# Altium schematic sheet Power_System.SchDoc
size 297 x 209 mm
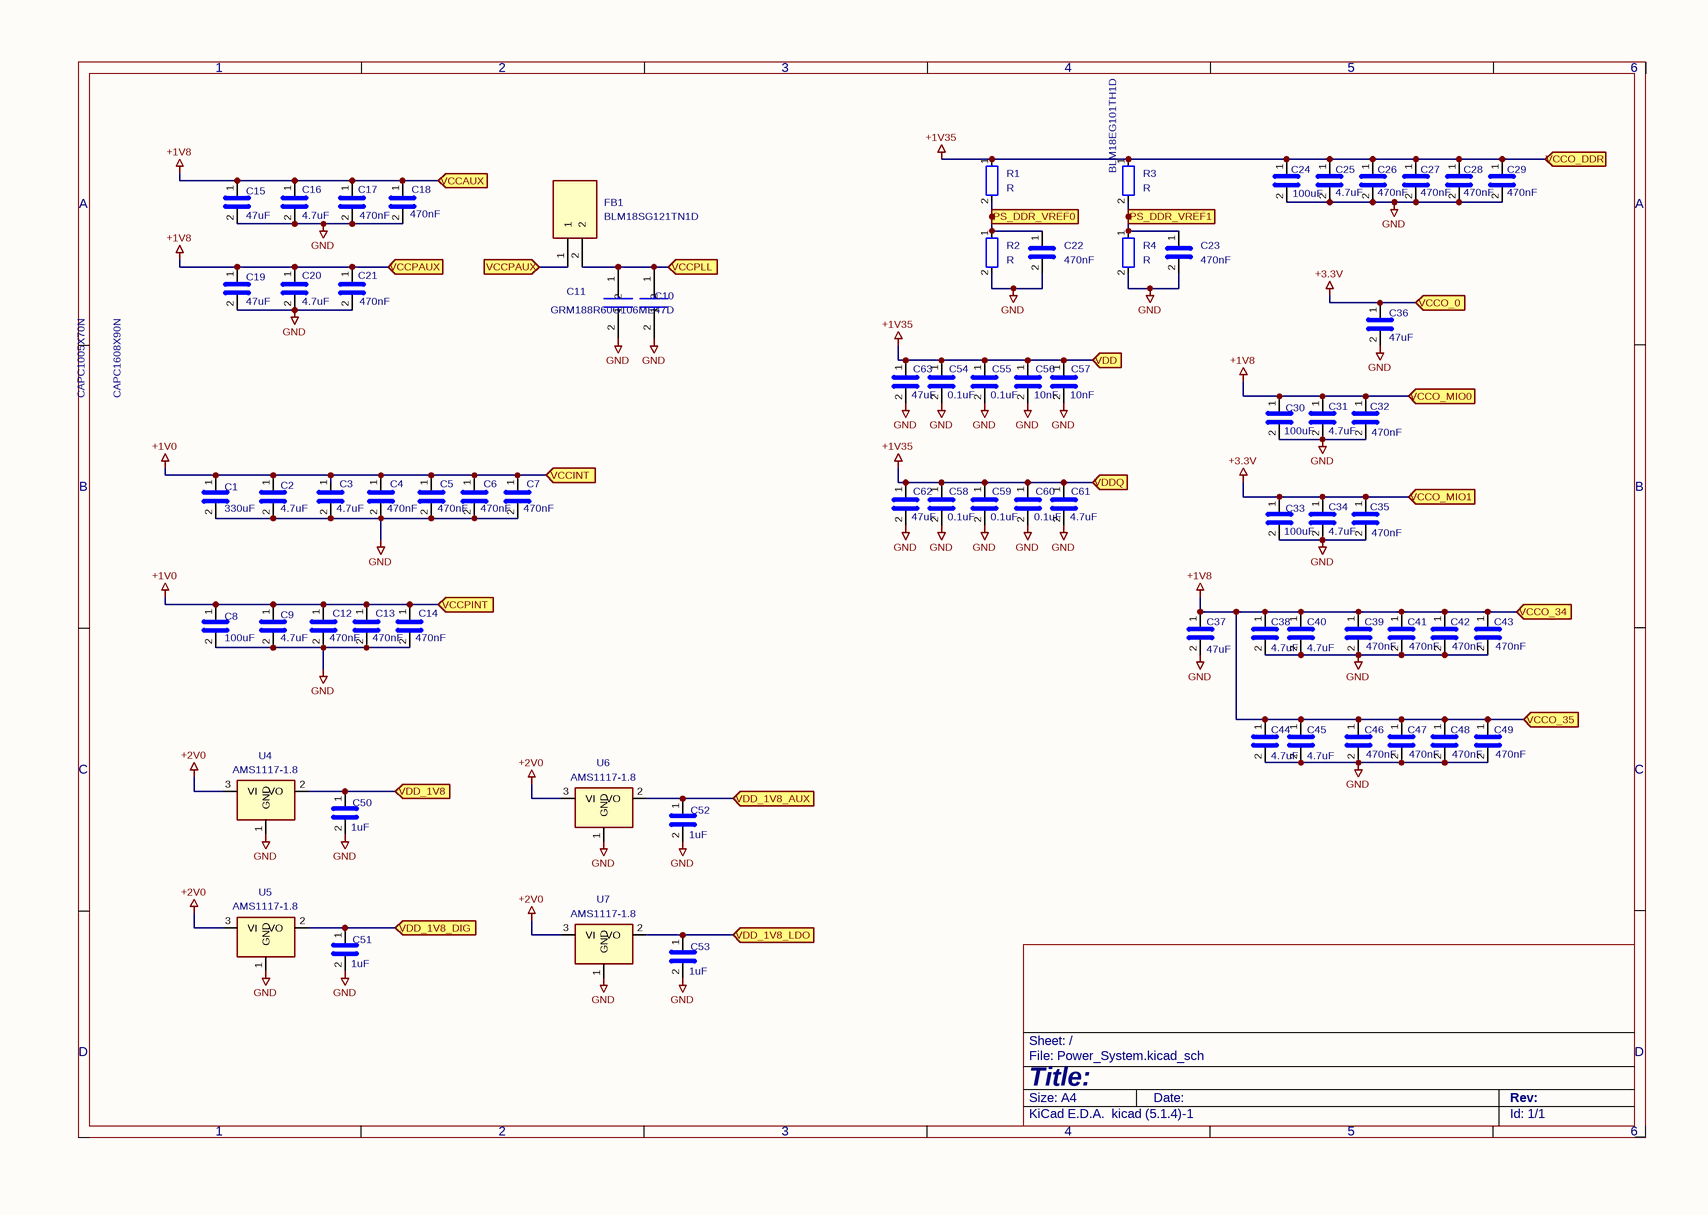
[diagram p0: Power_System.SchDoc]

## Parts
C1  330uF
C2  4.7uF  [C_0805_2012Metric_Pad1.18x1.45mm_HandSolder]
C3  4.7uF  [C_0805_2012Metric_Pad1.18x1.45mm_HandSolder]
C4  470nF  [C_0402_1005Metric_Pad0.74x0.62mm_HandSolder]
C5  470nF  [C_0402_1005Metric_Pad0.74x0.62mm_HandSolder]
C6  470nF  [C_0402_1005Metric_Pad0.74x0.62mm_HandSolder]
C7  470nF  [C_0402_1005Metric_Pad0.74x0.62mm_HandSolder]
C8  100uF  [C_0805_2012Metric_Pad1.18x1.45mm_HandSolder]
C9  4.7uF  [C_0805_2012Metric_Pad1.18x1.45mm_HandSolder]
C10  GRM188R60G106ME47D  [CAPC1608X90N]
C11  GRM155R60J474KE19D  [CAPC1005X70N]  (value not drawn)
C12  470nF  [C_0402_1005Metric_Pad0.74x0.62mm_HandSolder]
C13  470nF  [C_0402_1005Metric_Pad0.74x0.62mm_HandSolder]
C14  470nF  [C_0402_1005Metric_Pad0.74x0.62mm_HandSolder]
C15  47uF  [C_0805_2012Metric_Pad1.18x1.45mm_HandSolder]
C16  4.7uF  [C_0805_2012Metric_Pad1.18x1.45mm_HandSolder]
C17  470nF  [C_0402_1005Metric_Pad0.74x0.62mm_HandSolder]
C18  470nF  [C_0402_1005Metric_Pad0.74x0.62mm_HandSolder]
C19  47uF  [C_0805_2012Metric_Pad1.18x1.45mm_HandSolder]
C20  4.7uF  [C_0805_2012Metric_Pad1.18x1.45mm_HandSolder]
C21  470nF  [C_0402_1005Metric_Pad0.74x0.62mm_HandSolder]
C22  470nF  [C_0402_1005Metric_Pad0.74x0.62mm_HandSolder]
C23  470nF  [C_0402_1005Metric_Pad0.74x0.62mm_HandSolder]
C24  100uF  [C_0805_2012Metric_Pad1.18x1.45mm_HandSolder]
C25  4.7uF  [C_0805_2012Metric_Pad1.18x1.45mm_HandSolder]
C26  470nF  [C_0402_1005Metric_Pad0.74x0.62mm_HandSolder]
C27  470nF  [C_0402_1005Metric_Pad0.74x0.62mm_HandSolder]
C28  470nF  [C_0402_1005Metric_Pad0.74x0.62mm_HandSolder]
C29  470nF  [C_0402_1005Metric_Pad0.74x0.62mm_HandSolder]
C30  100uF  [C_0805_2012Metric_Pad1.18x1.45mm_HandSolder]
C31  4.7uF  [C_0805_2012Metric_Pad1.18x1.45mm_HandSolder]
C32  470nF  [C_0402_1005Metric_Pad0.74x0.62mm_HandSolder]
C33  100uF  [C_0805_2012Metric_Pad1.18x1.45mm_HandSolder]
C34  4.7uF  [C_0805_2012Metric_Pad1.18x1.45mm_HandSolder]
C35  470nF  [C_0402_1005Metric_Pad0.74x0.62mm_HandSolder]
C36  47uF  [C_0805_2012Metric_Pad1.18x1.45mm_HandSolder]
C37  47uF  [C_0805_2012Metric_Pad1.18x1.45mm_HandSolder]
C38  4.7uF  [C_0805_2012Metric_Pad1.18x1.45mm_HandSolder]
C39  470nF  [C_0402_1005Metric_Pad0.74x0.62mm_HandSolder]
C40  4.7uF  [C_0805_2012Metric_Pad1.18x1.45mm_HandSolder]
C41  470nF  [C_0402_1005Metric_Pad0.74x0.62mm_HandSolder]
C42  470nF  [C_0402_1005Metric_Pad0.74x0.62mm_HandSolder]
C43  470nF  [C_0402_1005Metric_Pad0.74x0.62mm_HandSolder]
C44  4.7uF  [C_0805_2012Metric_Pad1.18x1.45mm_HandSolder]
C45  4.7uF  [C_0805_2012Metric_Pad1.18x1.45mm_HandSolder]
C46  470nF  [C_0402_1005Metric_Pad0.74x0.62mm_HandSolder]
C47  470nF  [C_0402_1005Metric_Pad0.74x0.62mm_HandSolder]
C48  470nF  [C_0402_1005Metric_Pad0.74x0.62mm_HandSolder]
C49  470nF  [C_0402_1005Metric_Pad0.74x0.62mm_HandSolder]
C50  1uF  [C_0805_2012Metric_Pad1.18x1.45mm_HandSolder]
C51  1uF  [C_0805_2012Metric_Pad1.18x1.45mm_HandSolder]
C52  1uF  [C_0805_2012Metric_Pad1.18x1.45mm_HandSolder]
C53  1uF  [C_0805_2012Metric_Pad1.18x1.45mm_HandSolder]
C54  0.1uF  [C_0402_1005Metric]
C55  0.1uF  [C_0402_1005Metric]
C56  10nF  [C_0402_1005Metric]
C57  10nF  [C_0402_1005Metric_Pad0.74x0.62mm_HandSolder]
C58  0.1uF  [C_0402_1005Metric]
C59  0.1uF  [C_0402_1005Metric]
C60  0.1uF  [C_0402_1005Metric]
C61  4.7uF  [C_0402_1005Metric_Pad0.74x0.62mm_HandSolder]
C62  47uF  [C_0805_2012Metric_Pad1.18x1.45mm_HandSolder]
C63  47uF  [C_0805_2012Metric_Pad1.18x1.45mm_HandSolder]
FB1  BLM18SG121TN1D  [BLM18EG101TH1D]
R1  R
R2  R
R3  R
R4  R
U4  AMS1117-1.8  [SOT-223-3_TabPin2]
U5  AMS1117-1.8  [SOT-223-3_TabPin2]
U6  AMS1117-1.8  [SOT-223-3_TabPin2]
U7  AMS1117-1.8  [SOT-223-3_TabPin2]

## Ports
PS_DDR_VREF0 (in), PS_DDR_VREF1 (in), VCCAUX (in), VCCINT (in), VCCO_0 (in), VCCO_34 (in), VCCO_35 (in), VCCO_DDR (in), VCCO_MIO0 (in), VCCO_MIO1 (in), VCCPAUX (in), VCCPINT (in), VCCPLL (in), VDD (in), VDD_1V8 (in), VDD_1V8_AUX (in), VDD_1V8_DIG (in), VDD_1V8_LDO (in), VDDQ (in)

## Nets
+1V0: C1.1 C2.1 C3.1 C4.1 C5.1 C6.1 C7.1 C8.1 C9.1 C12.1 C13.1 C14.1 ; port VCCPINT, port VCCINT
+1V8: C15.1 C16.1 C17.1 C18.1 C19.1 C20.1 C21.1 C30.1 C31.1 C32.1 C37.1 C38.1 C39.1 C40.1 C41.1 C42.1 C43.1 C44.1 C45.1 C46.1 C47.1 C48.1 C49.1 FB1.1 ; port VCCO_MIO0, port VCCO_34, port VCCPAUX, port VCCO_35, port VCCAUX
+1V35: C24.1 C25.1 C26.1 C27.1 C28.1 C29.1 C54.1 C55.1 C56.1 C57.1 C58.1 C59.1 C60.1 C61.1 C62.1 C63.1 R1.1 R3.1 ; port VCCO_DDR, port VDDQ, port VDD
+2V0: U4.3(VI) U5.3(VI) U6.3(VI) U7.3(VI)
+3.3V: C33.1 C34.1 C35.1 C36.1 ; port VCCO_MIO1, port VCCO_0
GND: C1.2 C2.2 C3.2 C4.2 C5.2 C6.2 C7.2 C8.2 C9.2 C10.2 C11.2 C12.2 C13.2 C14.2 C15.2 C16.2 C17.2 C18.2 C19.2 C20.2 C21.2 C22.2 C23.2 C24.2 C25.2 C26.2 C27.2 C28.2 C29.2 C30.2 C31.2 C32.2 C33.2 C34.2 C35.2 C36.2 C37.2 C38.2 C39.2 C40.2 C41.2 C42.2 C43.2 C44.2 C45.2 C46.2 C47.2 C48.2 C49.2 C50.2 C51.2 C52.2 C53.2 C54.2 C55.2 C56.2 C57.2 C58.2 C59.2 C60.2 C61.2 C62.2 C63.2 R2.2 R4.2 U4.1(GND) U5.1(GND) U6.1(GND) U7.1(GND)
PS_DDR_VREF0: C22.1 R1.2 R2.1 ; port PS_DDR_VREF0
PS_DDR_VREF1: C23.1 R3.2 R4.1 ; port PS_DDR_VREF1
VCCPLL: C10.1 C11.1 FB1.2 ; port VCCPLL
VDD_1V8: C50.1 U4.2(VO) ; port VDD_1V8
VDD_1V8_AUX: C52.1 U6.2(VO) ; port VDD_1V8_AUX
VDD_1V8_DIG: C51.1 U5.2(VO) ; port VDD_1V8_DIG
VDD_1V8_LDO: C53.1 U7.2(VO) ; port VDD_1V8_LDO

## Notes on the sheet
- 1
- 2
- 3
- 4
- 5
- 6
- A
- B
- C
- D
- Title:
- File: Power_System.kicad_sch
- Sheet: /
- KiCad E.D.A.  kicad (5.1.4)-1
- Size: A4
- Date:
- Rev:
- Id: 1/1

## Library data of the parts
C1-C9 C12-C63 = C
  C1: Value: 330uF
  C2 C3 C9 C16 C20 C25 C31 C34 C38 C40 C44 C45 C61: Value: 4.7uF
  C4-C7 C12-C14 C17 C18 C21-C23 C26-C29 C32 C35 C39 C41-C43 C46-C49: Value: 470nF
  C8 C24 C30 C33: Value: 100uF
  C15 C19 C36 C37 C62 C63: Value: 47uF
  C50-C53: Value: 1uF
  C54 C55 C58-C60: Value: 0.1uF
  C56 C57: Value: 10nF
C10 = GRM188R60G106ME47D: Value: GRM188R60G106ME47D
FB1 = BLM18SG121TN1D: Value: BLM18SG121TN1D
R1-R4 = R: Value: R
U4-U7 = AMS1117-1.8: Value: AMS1117-1.8